# EAGLE schematic MCU (EAGLE 8.6.0)
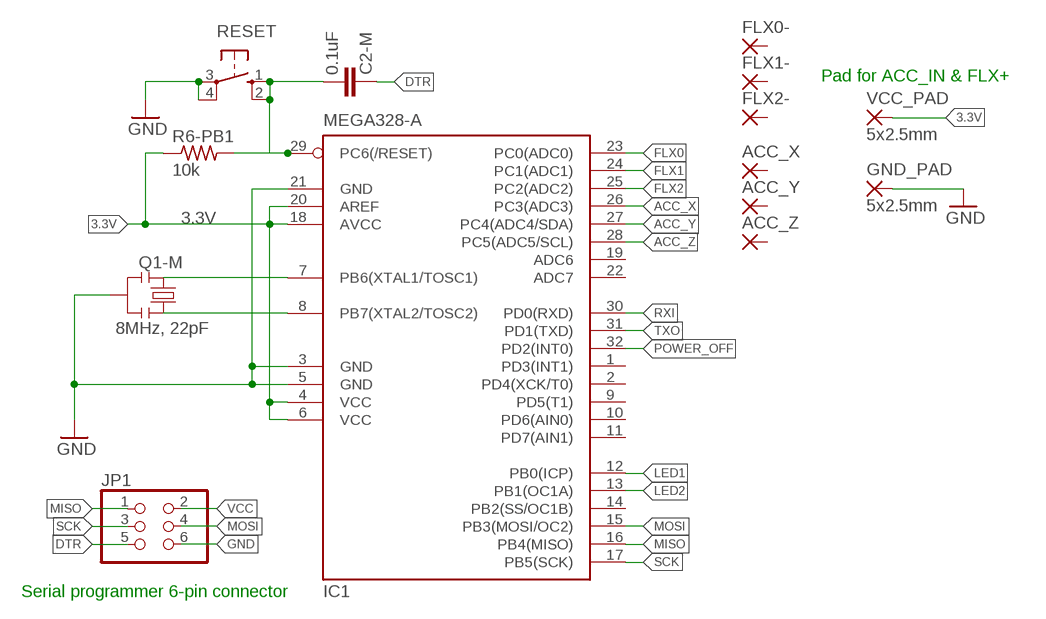
[diagram p0: schematic, sheet 1]

## Parts
ACC_X  1,6/0,8  [1,6/0,8]
ACC_Y  1,6/0,8  [1,6/0,8]
ACC_Z  1,6/0,8  [1,6/0,8]
C2-M  0.1uF  CAP0603-CAP  [0603-CAP]
FLX0-  1,6/0,8  [1,6/0,8]
FLX1-  1,6/0,8  [1,6/0,8]
FLX2-  1,6/0,8  [1,6/0,8]
GND_PAD  5x2.5mm  WIREPADSMD5-2,5  [5-2,5]
IC1  MEGA328-A  MEGA8-AI  [TQFP32-08]
JP1  PINHD-2X3  [2X03]
Q1-M  8MHz, 22pF  RESONATOR1:1  [RESONATOR-SMD-1:1]
R6-PB1  10k  R-US_R0805  [R0805]
RESET  10-XX  [B3F-10XX]
VCC_PAD  5x2.5mm  WIREPADSMD5-2,5  [5-2,5]

## Nets
3.3V [power]: IC1.4(VCC) IC1.6(VCC) IC1.18(AVCC) IC1.20(AREF) R6-PB1.1 VCC_PAD.1(P)
ACC_X: IC1.26(PC3(ADC3))
ACC_Y: IC1.27(PC4(ADC4/SDA))
ACC_Z: IC1.28(PC5(ADC5/SCL))
DTR: C2-M.2 JP1.5
FLX0: IC1.23(PC0(ADC0))
FLX2: IC1.25(PC2(ADC2))
FLX!: IC1.24(PC1(ADC1))
GND: GND_PAD.1(P) IC1.3(GND) IC1.5(GND) IC1.21(GND) JP1.6 Q1-M.2 RESET.3(P) RESET.4(P1)
MISO: IC1.16(PB4(MISO)) JP1.1
MOSI: IC1.15(PB3(MOSI/OC2)) JP1.4
N$2: C2-M.1 IC1.29(PC6(/RESET)) R6-PB1.2 RESET.1(S) RESET.2(S1)
N$3: IC1.7(PB6(XTAL1/TOSC1)) Q1-M.1
N$4: IC1.8(PB7(XTAL2/TOSC2)) Q1-M.3
N$13: IC1.12(PB0(ICP))
N$14: IC1.13(PB1(OC1A))
POWER_OFF [power]: IC1.32(PD2(INT0))
RXI: IC1.30(PD0(RXD))
SCK: IC1.17(PB5(SCK)) JP1.3
TXO: IC1.31(PD1(TXD))
VCC: JP1.2
Unconnected: ACC_X.1(P) ACC_Y.1(P) ACC_Z.1(P) FLX0-.1(P) FLX1-.1(P) FLX2-.1(P) IC1.1(PD3(INT1)) IC1.2(PD4(XCK/T0)) IC1.9(PD5(T1)) IC1.10(PD6(AIN0)) IC1.11(PD7(AIN1)) IC1.14(PB2(SS/OC1B)) IC1.19(ADC6) IC1.22(ADC7)

## Notes on the sheet
- Pad for ACC_IN & FLX+
- Serial programmer 6-pin connector

## Library data of the parts
ACC_X ACC_Y ACC_Z FLX0- FLX1- FLX2- = wirepad:1,6/0,8: THROUGH-HOLE PAD
C2-M = SparkFun:CAP: Capacitor Standard 0603 ceramic capacitor, and 0.1" leaded capacitor.
GND_PAD VCC_PAD = wirepad:WIREPAD: Wire PAD connect wire on PCB
IC1 = atmel:MEGA8: MICROCONTROLLER 8 Kbytes FLASH, 1 kbytes SRAM, 512 bytes EEPROM, USART, 6-channel 10 bit ADC, 2-channel 8 bit ADC Pin compatible with Atmega48, ATMega88, ATMega168 Source: avr.lbr; MPN: ATMEGA8-16AU; OC_FARNELL: 9171371; OC_NEWARK: 73M8863
JP1 = pinhead:PINHD-2X3: PIN HEADER
Q1-M = Testing:RESONATOR: Resonator Small SMD resonator. This is the itty bitty 10/20MHz resonators with built in caps. CSTCE10M0G55 and CSTCE20M0V53. Footprint for SMD has been used in SFE production for years, and does work okay. 1:1 is an attempt to get larger fillets on the sides so it will be easier to inspect these solders in our AOI machine. The pads have been minimized to match the actual metal under the resonator. To see this relation, it includes an image import of the bottom side of the component. Imported to scale on layer 200.
R6-PB1 = rcl:R-US_: RESISTOR, American symbol; SPICEPREFIX: R
RESET = switch-omron:10-XX: OMRON SWITCH; MPN: B3F-1000; OC_FARNELL: 176432; OC_NEWARK: 36M3542

## Net classes
0 default: width 0.203 mm
1 power: width 0.254 mm